# EAGLE design patch (EAGLE 7.5.0)
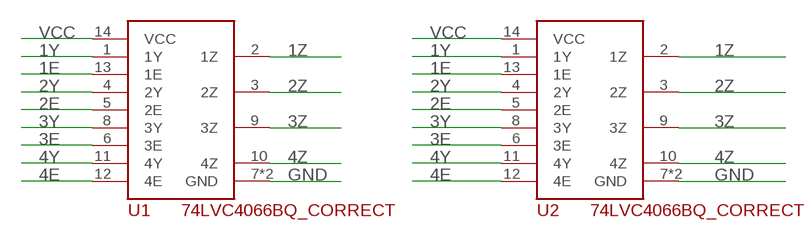
[diagram p0: schematic, sheet 1]

## Parts
U1  74LVC4066BQ_CORRECT  [DHVQFN14_CORRECTED]
U2  74LVC4066BQ_CORRECT  [DHVQFN14_CORRECTED]

## Nets
1E: U1.13(1E) U2.13(1E)
1Y: U1.1(1Y) U2.1(1Y)
1Z: U1.2(1Z) U2.2(1Z)
2E: U1.5(2E) U2.5(2E)
2Y: U1.4(2Y) U2.4(2Y)
2Z: U1.3(2Z) U2.3(2Z)
3E: U1.6(3E) U2.6(3E)
3Y: U1.8(3Y) U2.8(3Y)
3Z: U1.9(3Z) U2.9(3Z)
4E: U1.12(4E) U2.12(4E)
4Y: U1.11(4Y) U2.11(4Y)
4Z: U1.10(4Z) U2.10(4Z)
GND: U1.7(GND) U1.PADDLE(GND) U2.7(GND) U2.PADDLE(GND)
VCC: U1.14(VCC) U2.14(VCC)

## Library data of the parts
U1 U2 = imix:74LVC4066: 74LVC4066 bidirectional quad analog switch.; DATASHEET: http://www.digikey.com/product-detail/en/nexperia-usa-inc/74LVC4066BQ,115/568-3019-1-ND/1023424; MANUFACTURER: Nexperia USA Inc.; MPN: 74LVC4066BQ; VENDOR: Digikey; VPN: 568-3019-1-ND

## Board
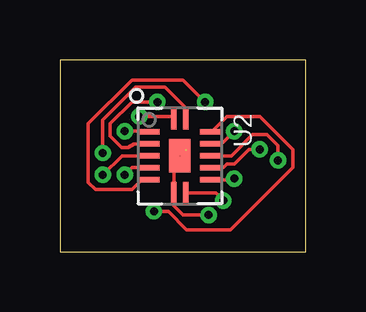
[diagram p1: board, top side]
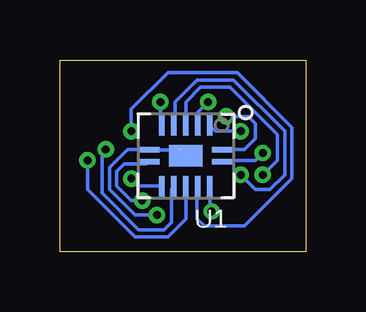
[diagram p2: board, bottom side, seen from below]

Size 10.25 x 8 mm. Coordinates in mm from the lower left corner, seen from the top.
Outline: 0,0 10.25,0 10.25,8 0,8 0,0
Copper layers (1*16): Top 0.0356mm / dielectric 1.5011mm / Bottom 0.0356mm
Design rules "oshpark-2layer *": minimum track width 6mil, minimum drill 13mil, track to track 6mil, track to pad 6mil, pad to pad 6mil, via to via 6mil, smd to smd 6mil, copper to edge 15mil, drill to drill 6mil, minimum pad ring 7mil, minimum via ring 7mil, stop-mask expansion 2.5mil, vias tented up to drill 13mil, thermal gap 10mil

### Footprints (pad centres in the part's own frame; a part is rotated, then mirrored left to right if it is on the bottom)
DHVQFN14_CORRECTED = smd 0.9 x 0.24: 1 -1.55,-0.25; 7 1.55,-0.25; 8 1.55,0.25; 14 -1.55,0.25 | smd 0.24 x 0.9: 2 -1,-1.3; 3 -0.5,-1.3; 4 0,-1.3; 5 0.5,-1.3; 6 1,-1.3; 9 1,1.3; 10 0.5,1.3; 11 0,1.3; 12 -0.5,1.3; 13 -1,1.3 | smd 1.4 x 0.9: PADDLE 0,0

### Placement (x,y rotation side)
U1  5,4 180 bottom
U2  5,4 270 top

### Tracks (layer width: path | path; a pad name or v marks a point on that pad's centre or on a via)
1E  (via drill 0.33)
  Top 0.152: v3.92,1.68 4.53,1.68 5.29,0.91 7.12,0.91 9.71,3.5 9.71,4.27 8.34,5.64 6.97,5.64 6.36,5.03 U2.13
  Bottom 0.152: U1.13 4,1.76 v3.92,1.68
1Y  (via drill 0.33)
  Top 0.152: v3.31,5.64 4.68,5.64 U2.1
  Bottom 0.152: v3.31,5.64 2.4,5.64 2.09,5.33 2.09,4.72 2.55,4.27 3.31,4.27 U1.1
1Z  (via drill 0.33)
  Top 0.152: v2.7,5.03 3.62,5.03 U2.2
  Bottom 0.152: v2.7,5.03 3.77,5.03 3.92,5.18 U1.2
2E  (via drill 0.33)
  Top 0.152: v2.7,3.2 3,3.5 3.62,3.5 U2.5
  Bottom 0.152: v2.7,3.2 2.09,2.59 1.48,2.59 0.87,3.2 0.87,5.03 3,7.16 4.53,7.16 5.44,6.25 5.44,5.33 U1.5
2Y  (via drill 0.33)
  Top 0.152: v1.79,3.2 2.59,4 U2.4
  Bottom 0.152: v1.79,3.2 1.18,3.81 1.18,4.88 3.16,6.86 4.38,6.86 4.99,6.25 4.99,5.33 U1.4
2Z  (via drill 0.33)
  Top 0.152: v4.07,6.25 3,6.25 2.09,5.33 2.09,4.82 2.56,4.35 2.85,4.35 3.1,4.5 U2.3
  Bottom 0.152: v4.07,6.25 4.53,5.79 4.53,5.33 U1.3
3E  (via drill 0.33)
  Top 0.152: v6.05,6.25 5.14,7.16 3,7.16 1.18,5.33 1.18,2.9 1.48,2.59 3,2.59 3.41,3 U2.6
  Bottom 0.152: v6.05,6.25 6.05,5.33 U1.6
3Y  (via drill 0.33)
  Top 0.152: v6.82,2.13 6.51,2.44 5.29,2.44 U2.8
  Bottom 0.152: v6.82,2.13 7.27,2.13 7.88,2.74 7.88,3.35 7.58,3.66 6.66,3.66 U1.8
3Z  (via drill 0.33)
  Top 0.152: U2.9 7.22,3 v7.27,3.05
  Bottom 0.152: v7.27,3.05 6.97,2.74 6.05,2.74 U1.9
4E  (via drill 0.33)
  Top 0.152: v7.27,5.03 6.74,4.5 U2.12
  Bottom 0.152: v7.27,5.03 7.27,5.94 5.75,7.47 2.85,7.47 0.57,5.18 0.57,3.05 2.55,1.07 4.22,1.07 4.53,1.37 4.53,2.59 U1.12
4Y  (via drill 0.33)
  Top 0.152: v9.1,3.81 9.1,4.42 8.64,4.88 8.03,4.88 7.16,4 U2.11
  Bottom 0.152: v9.1,3.81 9.1,2.59 7.12,0.61 5.75,0.61 4.99,1.37 4.99,2.59 U1.11
4Z  (via drill 0.33)
  Top 0.152: v8.34,4.27 7.88,4.27 7.27,3.66 6.97,3.66 6.82,3.5 6.36,3.5 U2.10
  Bottom 0.152: v8.34,4.27 8.49,4.12 8.49,2.44 6.97,0.91 5.9,0.91 5.6,1.22 5.6,2.59 U1.10
GND  (via drill 0.33)  (2 unrouted)
  Top 0.152: v6.21,1.52 5.14,1.52 4.75,1.91 U2.7 | U2.PADDLE 4.75,3.75 4.75,2.5
  Bottom 0.152: 5.14,4.12 5.29,4.27 | 6.51,4.27 U1.7 | v6.21,1.52 7.12,1.52 8.19,2.59 8.19,3.5 7.42,4.27 6.66,4.27 U1.7 | U2.PADDLE 5.25,4.25 U1.7
VCC  (via drill 0.33)
  Top 0.152: v1.79,4.12 1.79,5.49 3.16,6.86 4.38,6.86 5.25,5.99 U2.14
  Bottom 0.152: v1.79,4.12 2.09,3.81 3.31,3.81 U1.14